# Altium schematic sheet OZ440-SE100-CAR003_Sheet2.SchDoc
size A3
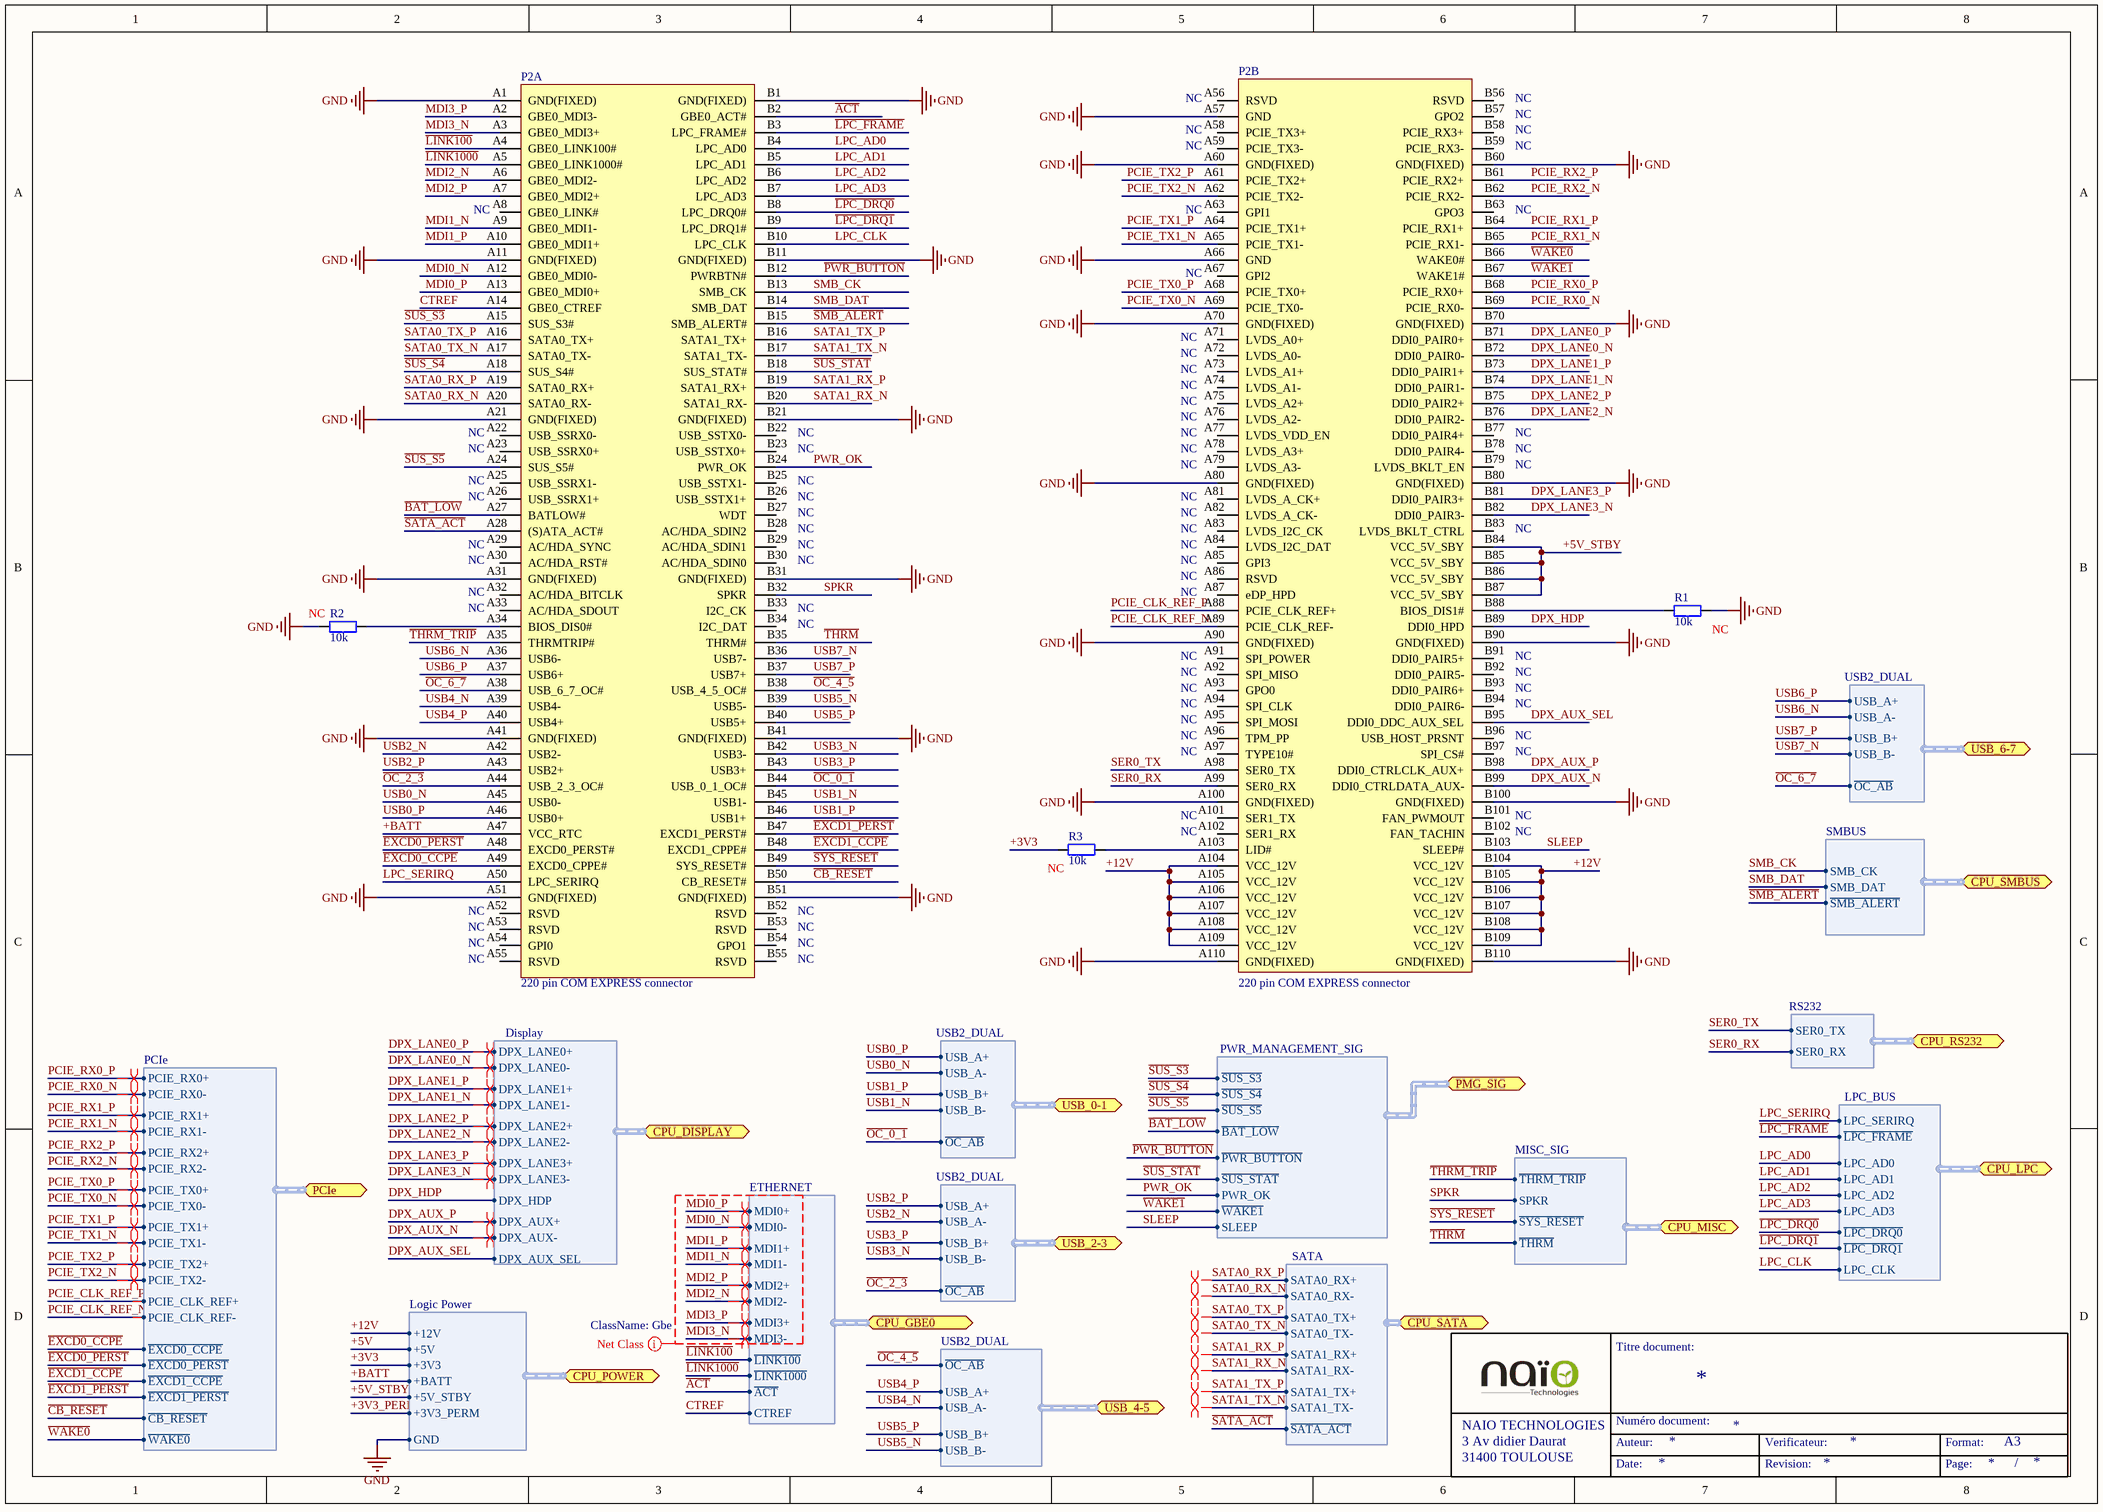
[diagram p0: OZ440-SE100-CAR003_Sheet2.SchDoc]

## Parts
P2  Displayed reference: 220 pin COM EXPRESS connector  [CONN-SPE_AMP_3-1827253-6]  (hidden comment: CONN-SPE-220P_AMP_3-1827253-6)  (parts A,B of 2)
R1  Displayed reference: 10k  [R0805-STD]  (hidden comment: RES-SMD)
R2  Displayed reference: 10k  [R0805-STD]  (hidden comment: RES-SMD)
R3  Displayed reference: 10k  [R0805-STD]  (hidden comment: RES-SMD)

## Ports
CPU_DISPLAY (harness Display), CPU_GBE0 (harness ETHERNET), CPU_LPC (harness LPC_BUS), CPU_MISC (harness MISC_SIG), CPU_POWER (harness Logic Power), CPU_RS232 (harness RS232), CPU_SATA (harness SATA), CPU_SMBUS (harness SMBUS), PCIe (harness PCIe), PMG_SIG (harness PWR_MANAGEMENT_SIG), USB_0-1 (harness USB2_DUAL), USB_2-3 (harness USB2_DUAL), USB_4-5 (harness USB2_DUAL), USB_6-7 (harness USB2_DUAL)

## Harnesses
PCIe: PCIE_RX0+, PCIE_RX0-, PCIE_RX1+, PCIE_RX1-, PCIE_RX2+, PCIE_RX2-, PCIE_TX0+, PCIE_TX0-, PCIE_TX1+, PCIE_TX1-, PCIE_TX2+, PCIE_TX2-, PCIE_CLK_REF+, PCIE_CLK_REF-, ~{EXCD0_CCPE}, ~{EXCD0_PERST}, ~{EXCD1_CCPE}, ~{EXCD1_PERST}, ~{CB_RESET}, ~{WAKE0}
Logic Power: +12V, +5V, +3V3, +BATT, +5V_STBY, GND, +3V3_PERM
Display: DPX_LANE0+, DPX_LANE0-, DPX_LANE1+, DPX_LANE1-, DPX_LANE2+, DPX_LANE2-, DPX_LANE3+, DPX_LANE3-, DPX_HDP, DPX_AUX+, DPX_AUX-, DPX_AUX_SEL
ETHERNET: MDI0+, MDI0-, MDI1+, MDI1-, MDI2+, MDI2-, MDI3+, MDI3-, ~{LINK100}, ~{LINK1000}, ~{ACT}, CTREF
USB2_DUAL: USB_A+, USB_A-, USB_B+, USB_B-, ~{OC_AB}
USB2_DUAL: ~{OC_AB}, USB_A-, USB_A+, USB_B-, USB_B+
SATA: SATA0_RX+, SATA0_RX-, SATA0_TX+, SATA0_TX-, SATA1_RX+, SATA1_RX-, SATA1_TX+, SATA1_TX-, ~{SATA_ACT}
PWR_MANAGEMENT_SIG: ~{SUS_S3}, ~{SUS_S4}, ~{SUS_S5}, ~{BAT_LOW}, ~{PWR_BUTTON}, ~{SUS_STAT}, PWR_OK, ~{WAKE1}, SLEEP
MISC_SIG: ~{THRM_TRIP}, SPKR, ~{SYS_RESET}, ~{THRM}
LPC_BUS: LPC_SERIRQ, ~{LPC_FRAME}, LPC_AD0, LPC_AD1, LPC_AD2, LPC_AD3, ~{LPC_DRQ0}, ~{LPC_DRQ1}, LPC_CLK
RS232: SER0_TX, SER0_RX
SMBUS: SMB_CK, SMB_DAT, ~{SMB_ALERT}

## Nets
GND: P2.A1(GND(FIXED)) P2.A11(GND(FIXED)) P2.A21(GND(FIXED)) P2.A31(GND(FIXED)) P2.A41(GND(FIXED)) P2.A51(GND(FIXED)) P2.A57(GND) P2.A60(GND(FIXED)) P2.A66(GND) P2.A70(GND(FIXED)) P2.A80(GND(FIXED)) P2.A90(GND(FIXED)) P2.A100(GND(FIXED)) P2.A110(GND(FIXED)) P2.B1(GND(FIXED)) P2.B11(GND(FIXED)) P2.B21(GND(FIXED)) P2.B31(GND(FIXED)) P2.B41(GND(FIXED)) P2.B51(GND(FIXED)) P2.B60(GND(FIXED)) P2.B70(GND(FIXED)) P2.B80(GND(FIXED)) P2.B90(GND(FIXED)) P2.B100(GND(FIXED)) P2.B110(GND(FIXED)) R1.1 R2.1 ; port CPU_POWER.GND
+3V3: R3.2 ; port CPU_POWER.+3V3
+3V3_PERM: port CPU_POWER.+3V3_PERM
+5V: port CPU_POWER.+5V
+5V_STBY: P2.B84(VCC_5V_SBY) P2.B85(VCC_5V_SBY) P2.B86(VCC_5V_SBY) P2.B87(VCC_5V_SBY) ; port CPU_POWER.+5V_STBY
+12V: P2.A104(VCC_12V) P2.A105(VCC_12V) P2.A106(VCC_12V) P2.A107(VCC_12V) P2.A108(VCC_12V) P2.A109(VCC_12V) P2.B104(VCC_12V) P2.B105(VCC_12V) P2.B106(VCC_12V) P2.B107(VCC_12V) P2.B108(VCC_12V) P2.B109(VCC_12V) ; port CPU_POWER.+12V
+BATT: P2.A47(VCC_RTC) ; port CPU_POWER.+BATT
~{ACT}: P2.B2(GBE0_ACT#) ; port CPU_GBE0.~{ACT}
~{BAT_LOW}: P2.A27(BATLOW#) ; port PMG_SIG.~{BAT_LOW}
~{CB_RESET}: P2.B50(CB_RESET#) ; port PCIe.~{CB_RESET}
~{EXCD0_CCPE}: P2.A49(EXCD0_CPPE#) ; port PCIe.~{EXCD0_CCPE}
~{EXCD0_PERST}: P2.A48(EXCD0_PERST#) ; port PCIe.~{EXCD0_PERST}
~{EXCD1_CCPE}: P2.B48(EXCD1_CPPE#) ; port PCIe.~{EXCD1_CCPE}
~{EXCD1_PERST}: P2.B47(EXCD1_PERST#) ; port PCIe.~{EXCD1_PERST}
~{LINK100}: P2.A4(GBE0_LINK100#) ; port CPU_GBE0.~{LINK100}
~{LINK1000}: P2.A5(GBE0_LINK1000#) ; port CPU_GBE0.~{LINK1000}
~{LPC_DRQ0}: P2.B8(LPC_DRQ0#) ; port CPU_LPC.~{LPC_DRQ0}
~{LPC_DRQ1}: P2.B9(LPC_DRQ1#) ; port CPU_LPC.~{LPC_DRQ1}
~{LPC_FRAME}: P2.B3(LPC_FRAME#) ; port CPU_LPC.~{LPC_FRAME}
~{OC_0_1}: P2.B44(USB_0_1_OC#) ; port USB_0-1.~{OC_AB}
~{OC_2_3}: P2.A44(USB_2_3_OC#) ; port USB_2-3.~{OC_AB}
~{OC_4_5}: P2.B38(USB_4_5_OC#) ; port USB_4-5.~{OC_AB}
~{OC_6_7}: P2.A38(USB_6_7_OC#) ; port USB_6-7.~{OC_AB}
~{PWR_BUTTON}: P2.B12(PWRBTN#) ; port PMG_SIG.~{PWR_BUTTON}
~{SATA_ACT}: P2.A28((S)ATA_ACT#) ; port CPU_SATA.~{SATA_ACT}
~{SMB_ALERT}: P2.B15(SMB_ALERT#) ; port CPU_SMBUS.~{SMB_ALERT}
~{SUS_S3}: P2.A15(SUS_S3#) ; port PMG_SIG.~{SUS_S3}
~{SUS_S4}: P2.A18(SUS_S4#) ; port PMG_SIG.~{SUS_S4}
~{SUS_S5}: P2.A24(SUS_S5#) ; port PMG_SIG.~{SUS_S5}
~{SUS_STAT}: P2.B18(SUS_STAT#) ; port PMG_SIG.~{SUS_STAT}
~{SYS_RESET}: P2.B49(SYS_RESET#) ; port CPU_MISC.~{SYS_RESET}
~{THRM}: P2.B35(THRM#) ; port CPU_MISC.~{THRM}
~{THRM_TRIP}: P2.A35(THRMTRIP#) ; port CPU_MISC.~{THRM_TRIP}
~{WAKE0}: P2.B66(WAKE0#) ; port PCIe.~{WAKE0}
~{WAKE1}: P2.B67(WAKE1#) ; port PMG_SIG.~{WAKE1}
CTREF: P2.A14(GBE0_CTREF) ; port CPU_GBE0.CTREF
DPX_AUX_N: P2.B99(DDI0_CTRLDATA_AUX-) ; port CPU_DISPLAY.DPX_AUX-
DPX_AUX_P: P2.B98(DDI0_CTRLCLK_AUX+) ; port CPU_DISPLAY.DPX_AUX+
DPX_AUX_SEL: P2.B95(DDI0_DDC_AUX_SEL) ; port CPU_DISPLAY.DPX_AUX_SEL
DPX_HDP: P2.B89(DDI0_HPD) ; port CPU_DISPLAY.DPX_HDP
DPX_LANE0_N: P2.B72(DDI0_PAIR0-) ; port CPU_DISPLAY.DPX_LANE0-
DPX_LANE0_P: P2.B71(DDI0_PAIR0+) ; port CPU_DISPLAY.DPX_LANE0+
DPX_LANE1_N: P2.B74(DDI0_PAIR1-) ; port CPU_DISPLAY.DPX_LANE1-
DPX_LANE1_P: P2.B73(DDI0_PAIR1+) ; port CPU_DISPLAY.DPX_LANE1+
DPX_LANE2_N: P2.B76(DDI0_PAIR2-) ; port CPU_DISPLAY.DPX_LANE2-
DPX_LANE2_P: P2.B75(DDI0_PAIR2+) ; port CPU_DISPLAY.DPX_LANE2+
DPX_LANE3_N: P2.B82(DDI0_PAIR3-) ; port CPU_DISPLAY.DPX_LANE3-
DPX_LANE3_P: P2.B81(DDI0_PAIR3+) ; port CPU_DISPLAY.DPX_LANE3+
LPC_AD0: P2.B4(LPC_AD0) ; port CPU_LPC.LPC_AD0
LPC_AD1: P2.B5(LPC_AD1) ; port CPU_LPC.LPC_AD1
LPC_AD2: P2.B6(LPC_AD2) ; port CPU_LPC.LPC_AD2
LPC_AD3: P2.B7(LPC_AD3) ; port CPU_LPC.LPC_AD3
LPC_CLK: P2.B10(LPC_CLK) ; port CPU_LPC.LPC_CLK
LPC_SERIRQ: P2.A50(LPC_SERIRQ) ; port CPU_LPC.LPC_SERIRQ
MDI0_N: P2.A12(GBE0_MDI0-) ; port CPU_GBE0.MDI0-
MDI0_P: P2.A13(GBE0_MDI0+) ; port CPU_GBE0.MDI0+
MDI1_N: P2.A9(GBE0_MDI1-) ; port CPU_GBE0.MDI1-
MDI1_P: P2.A10(GBE0_MDI1+) ; port CPU_GBE0.MDI1+
MDI2_N: P2.A6(GBE0_MDI2-) ; port CPU_GBE0.MDI2-
MDI2_P: P2.A7(GBE0_MDI2+) ; port CPU_GBE0.MDI2+
MDI3_N: P2.A3(GBE0_MDI3+) ; port CPU_GBE0.MDI3-
MDI3_P: P2.A2(GBE0_MDI3-) ; port CPU_GBE0.MDI3+
PCIE_CLK_REF_N: P2.A89(PCIE_CLK_REF-) ; port PCIe.PCIE_CLK_REF-
PCIE_CLK_REF_P: P2.A88(PCIE_CLK_REF+) ; port PCIe.PCIE_CLK_REF+
PCIE_RX0_N: P2.B69(PCIE_RX0-) ; port PCIe.PCIE_RX0-
PCIE_RX0_P: P2.B68(PCIE_RX0+) ; port PCIe.PCIE_RX0+
PCIE_RX1_N: P2.B65(PCIE_RX1-) ; port PCIe.PCIE_RX1-
PCIE_RX1_P: P2.B64(PCIE_RX1+) ; port PCIe.PCIE_RX1+
PCIE_RX2_N: P2.B62(PCIE_RX2-) ; port PCIe.PCIE_RX2-
PCIE_RX2_P: P2.B61(PCIE_RX2+) ; port PCIe.PCIE_RX2+
PCIE_TX0_N: P2.A69(PCIE_TX0-) ; port PCIe.PCIE_TX0-
PCIE_TX0_P: P2.A68(PCIE_TX0+) ; port PCIe.PCIE_TX0+
PCIE_TX1_N: P2.A65(PCIE_TX1-) ; port PCIe.PCIE_TX1-
PCIE_TX1_P: P2.A64(PCIE_TX1+) ; port PCIe.PCIE_TX1+
PCIE_TX2_N: P2.A62(PCIE_TX2-) ; port PCIe.PCIE_TX2-
PCIE_TX2_P: P2.A61(PCIE_TX2+) ; port PCIe.PCIE_TX2+
PWR_OK: P2.B24(PWR_OK) ; port PMG_SIG.PWR_OK
SATA0_RX_N: P2.A20(SATA0_RX-) ; port CPU_SATA.SATA0_RX-
SATA0_RX_P: P2.A19(SATA0_RX+) ; port CPU_SATA.SATA0_RX+
SATA0_TX_N: P2.A17(SATA0_TX-) ; port CPU_SATA.SATA0_TX-
SATA0_TX_P: P2.A16(SATA0_TX+) ; port CPU_SATA.SATA0_TX+
SATA1_RX_N: P2.B20(SATA1_RX-) ; port CPU_SATA.SATA1_RX-
SATA1_RX_P: P2.B19(SATA1_RX+) ; port CPU_SATA.SATA1_RX+
SATA1_TX_N: P2.B17(SATA1_TX-) ; port CPU_SATA.SATA1_TX-
SATA1_TX_P: P2.B16(SATA1_TX+) ; port CPU_SATA.SATA1_TX+
SER0_RX: P2.A99(SER0_RX) ; port CPU_RS232.SER0_RX
SER0_TX: P2.A98(SER0_TX) ; port CPU_RS232.SER0_TX
SLEEP: P2.B103(SLEEP#) ; port PMG_SIG.SLEEP
SMB_CK: P2.B13(SMB_CK) ; port CPU_SMBUS.SMB_CK
SMB_DAT: P2.B14(SMB_DAT) ; port CPU_SMBUS.SMB_DAT
SPKR: P2.B32(SPKR) ; port CPU_MISC.SPKR
USB0_N: P2.A45(USB0-) ; port USB_0-1.USB_A-
USB0_P: P2.A46(USB0+) ; port USB_0-1.USB_A+
USB1_N: P2.B45(USB1-) ; port USB_0-1.USB_B-
USB1_P: P2.B46(USB1+) ; port USB_0-1.USB_B+
USB2_N: P2.A42(USB2-) ; port USB_2-3.USB_A-
USB2_P: P2.A43(USB2+) ; port USB_2-3.USB_A+
USB3_N: P2.B42(USB3-) ; port USB_2-3.USB_B-
USB3_P: P2.B43(USB3+) ; port USB_2-3.USB_B+
USB4_N: P2.A39(USB4-) ; port USB_4-5.USB_A-
USB4_P: P2.A40(USB4+) ; port USB_4-5.USB_A+
USB5_N: P2.B39(USB5-) ; port USB_4-5.USB_B-
USB5_P: P2.B40(USB5+) ; port USB_4-5.USB_B+
USB6_N: P2.A36(USB6-) ; port USB_6-7.USB_A-
USB6_P: P2.A37(USB6+) ; port USB_6-7.USB_A+
USB7_N: P2.B36(USB7-) ; port USB_6-7.USB_B-
USB7_P: P2.B37(USB7+) ; port USB_6-7.USB_B+
NetP2_A34: P2.A34(BIOS_DIS0#) R2.2
NetP2_A103: P2.A103(LID#) R3.1
NetP2_B88: P2.B88(BIOS_DIS1#) R1.2

Not connected (* = marked no-connect by the designer): P2 A8(GBE0_LINK#) A22(USB_SSRX0-) A23(USB_SSRX0+) A25(USB_SSRX1-) A26(USB_SSRX1+) A29(AC/HDA_SYNC) A30(AC/HDA_RST#) A32(AC/HDA_BITCLK) A33(AC/HDA_SDOUT) A52(RSVD) A53(RSVD) A54(GPI0) A55(RSVD) A56(RSVD) A58(PCIE_TX3+) A59(PCIE_TX3-) A63(GPI1) A67(GPI2) A71(LVDS_A0+) A72(LVDS_A0-) A73(LVDS_A1+) A74(LVDS_A1-) A75(LVDS_A2+) A76(LVDS_A2-) A77(LVDS_VDD_EN) A78(LVDS_A3+) A79(LVDS_A3-) A81(LVDS_A_CK+) A82(LVDS_A_CK-) A83(LVDS_I2C_CK) A84(LVDS_I2C_DAT) A85(GPI3) A86(RSVD) A87(eDP_HPD) A91(SPI_POWER) A92(SPI_MISO) A93(GPO0) A94(SPI_CLK) A95(SPI_MOSI) A96(TPM_PP) A97(TYPE10#) A101(SER1_TX) A102(SER1_RX) B22(USB_SSTX0-) B23(USB_SSTX0+) B25(USB_SSTX1-) B26(USB_SSTX1+) B27(WDT) B28(AC/HDA_SDIN2) B29(AC/HDA_SDIN1) B30(AC/HDA_SDIN0) B33(I2C_CK) B34(I2C_DAT) B52(RSVD) B53(RSVD) B54(GPO1) B55(RSVD) B56(RSVD) B57(GPO2) B58(PCIE_RX3+) B59(PCIE_RX3-) B63(GPO3) B77(DDI0_PAIR4+) B78(DDI0_PAIR4-) B79(LVDS_BKLT_EN) B83(LVDS_BKLT_CTRL) B91(DDI0_PAIR5+) B92(DDI0_PAIR5-) B93(DDI0_PAIR6+) B94(DDI0_PAIR6-) B96(USB_HOST_PRSNT) B97(SPI_CS#) B101(FAN_PWMOUT) B102(FAN_TACHIN)

## Layout directives
differential pair: DPX_AUX_N, DPX_AUX_P, DPX_LANE0_N, DPX_LANE0_P, DPX_LANE1_N, DPX_LANE1_P, DPX_LANE2_N, DPX_LANE2_P, DPX_LANE3_N, DPX_LANE3_P, MDI0_N, MDI0_P, MDI1_N, MDI1_P, MDI2_N, MDI2_P, MDI3_N, MDI3_P, PCIE_CLK_REF_N, PCIE_CLK_REF_P, PCIE_RX0_N, PCIE_RX0_P, PCIE_RX1_N, PCIE_RX1_P, PCIE_RX2_N, PCIE_RX2_P, PCIE_TX0_N, PCIE_TX0_P, PCIE_TX1_N, PCIE_TX1_P, PCIE_TX2_N, PCIE_TX2_P, SATA0_RX_N, SATA0_RX_P, SATA0_TX_N, SATA0_TX_P, SATA1_RX_N, SATA1_RX_P, SATA1_TX_N, SATA1_TX_P
net class Gbe: MDI0_N, MDI0_P, MDI1_N, MDI1_P, MDI2_N, MDI2_P, MDI3_N, MDI3_P

## Notes on the sheet
- (near P2) NC
- (near R2) NC
- (near R1) NC
- (near R3) NC
- Titre document:
- NAIO TECHNOLOGIES
- 3 Av didier Daurat
- 31400 TOULOUSE
- Auteur:
- Numéro document:
- Verificateur:
- Format:
- A3
- Date:
- Revision:
- Page:
- /

## Library data of the parts
P2 = 3-1827253-6: type 10 com express connector; Manufacturer: TE connectivity; Max Current: 1.5; Validated: False; Reference: 3-1827253-6; Footprint description: 220 pin SMD; Pin Count: 220; Rev: C; helpURL: http://www.te.com/catalog/pn/en/3-1827253-6; Supplier 1: Mouser; Supplier Part Number 1: 571-3-1827253-6; Supplier 2: Farnell; Supplier Part Number 2: 2059779
R1-R3 = CRCW080510K0FKxx: 10k Ohm 0805 SMD resistor; Manufacturer: Vishay; Value: 10 000; Tolerance: 1 %; Rated Power: 0,125 W; Validated: No; Reference: CRCW080510K0FKxx; Footprint description: standard 0805 SMD; Pin Count: 2; helpURL: http://www.vishay.com/docs/20035/dcrcwe3.pdf; Supplier 1: Farnell; Supplier Part Number 1: 1469856; Supplier 2: Mouser; Supplier Part Number 2: 71-CRCW0805-10K-E3